# EAGLE design IRIS1304_v1.3 (EAGLE 6.6.0)
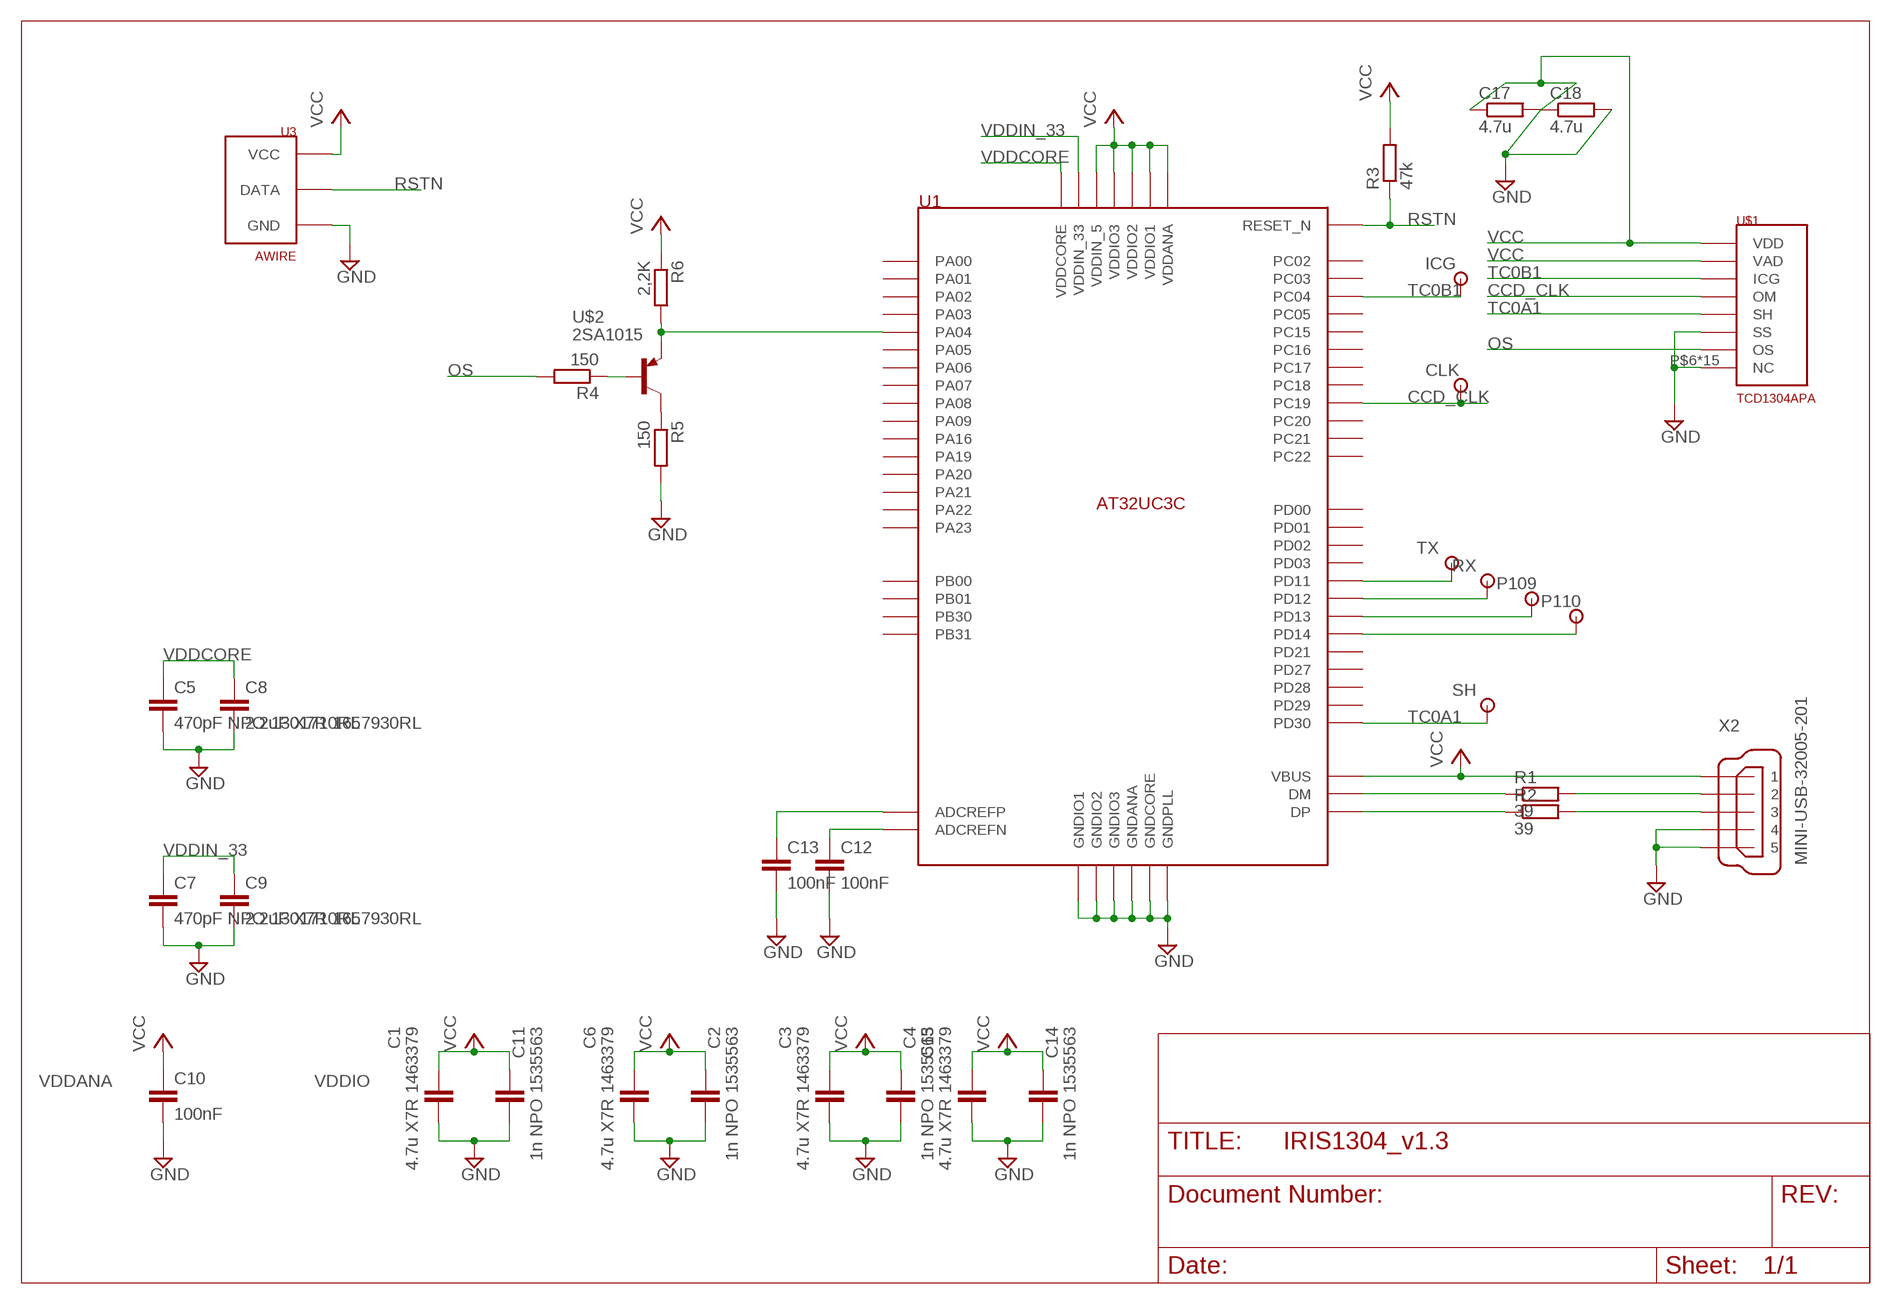
[diagram p0: schematic, sheet 1]

## Parts
C1  4.7u X7R 1463379  C-EUC0603  [C0603]
C2  1n NPO 1535563  C-EUC0402  [C0402]
C3  4.7u X7R 1463379  C-EUC0603  [C0603]
C4  1n NPO 1535563  C-EUC0402  [C0402]
C5  470pF NPO 1301710RL  C-EUC0603  [C0603]
C6  4.7u X7R 1463379  C-EUC0603  [C0603]
C7  470pF NPO 1301710RL  C-EUC0603  [C0603]
C8  2.2uF X7R 1657930RL  C-EUC0603  [C0603]
C9  2.2uF X7R 1657930RL  C-EUC0603  [C0603]
C10  100nF  C-EUC0603  [C0603]
C11  1n NPO 1535563  C-EUC0402  [C0402]
C12  100nF  C-EUC0603  [C0603]
C13  100nF  C-EUC0603  [C0603]
C14  1n NPO 1535563  C-EUC0402  [C0402]
C15  4.7u X7R 1463379  C-EUC0603  [C0603]
C17  4.7u  R-EU_R0603  [R0603]
C18  4.7u  R-EU_R0603  [R0603]
CLK  TP  [TP]
ICG  TP  [TP]
P109  TP  [TP]
P110  TP  [TP]
R1  39  R-EU_R0603  [R0603]
R2  39  R-EU_R0603  [R0603]
R3  47k  R-EU_R0603  [R0603]
R4  150  R-EU_R0603  [R0603]
R5  150  R-EU_M0805  [M0805]
R6  2,2K  R-EU_R0603  [R0603]
RX  TP  [TP]
SH  TP  [TP]
TX  TP  [TP]
U1  AT32UC3C  [TQFP64]
U3  AWIRE  [AWIRE]
U$1  TCD1304APA  [ILX511]
U$2  2SA1015  [SOT23]
X2  MINI-USB-32005-201  [32005-201]

## Nets
CCD_CLK: CLK.P$1 U1.P$43(PC19) U$1.P$4(OM)
GND: C1.2 C2.2 C3.2 C4.2 C5.2 C6.2 C7.2 C8.2 C9.2 C10.2 C11.2 C12.2 C13.2 C14.2 C15.2 C17.2 C18.2 R5.2 U1.P$6(GNDIO1) U1.P$17(GNDANA) U1.P$26(GNDPLL) U1.P$30(GNDCORE) U1.P$36(GNDIO2) U1.P$52(GNDIO3) U3.P$3(GND) U$1.P$6(NC) U$1.P$7(NC) U$1.P$8(NC) U$1.P$9(NC) U$1.P$10(NC) U$1.P$11(NC) U$1.P$12(NC) U$1.P$13(NC) U$1.P$14(NC) U$1.P$15(NC) U$1.P$16(NC) U$1.P$17(NC) U$1.P$18(NC) U$1.P$19(NC) U$1.P$20(NC) U$1.P$22(SS) X2.4 X2.5
N$1: R1.1 U1.P$24(DM)
N$2: R2.1 U1.P$25(DP)
N$3: R1.2 X2.2
N$4: R2.2 X2.3
N$5: R6.2 U1.P$7(PA04) U$2.2(E)
N$6: C13.1 U1.P$14(ADCREFP)
N$7: R5.1 U$2.3(C)
N$8: R4.1 U$2.1(B)
N$9: C12.1 U1.P$15(ADCREFN)
N$10: P109.P$1 U1.P$55(PD13)
N$11: RX.P$1 U1.P$54(PD12)
N$12: P110.P$1 U1.P$56(PD14)
N$13: TX.P$1 U1.P$53(PD11)
OS: R4.2 U$1.P$21(OS)
RSTN: R3.1 U1.P$64(RESET_N) U3.P$2(DATA)
TC0A1: SH.P$1 U1.P$61(PD30) U$1.P$5(SH)
TC0B1: ICG.P$1 U1.P$37(PC04) U$1.P$3(ICG)
VCC: C1.1 C2.1 C3.1 C4.1 C6.1 C10.1 C11.1 C14.1 C15.1 C17.1 C18.1 R3.2 R6.1 U1.P$5(VDDIO1) U1.P$18(VDDANA) U1.P$23(VBUS) U1.P$27(VDDIN_5) U1.P$35(VDDIO2) U1.P$51(VDDIO3) U3.P$1(VCC) U$1.P$1(VDD) U$1.P$2(VAD) X2.1
VDDCORE: C5.1 C8.1 U1.P$29(VDDCORE)
VDDIN_33: C7.1 C9.1 U1.P$28(VDDIN_33)
Unconnected: U1.P$1(PA00) U1.P$2(PA01) U1.P$3(PA02) U1.P$4(PA03) U1.P$8(PA05) U1.P$9(PA06) U1.P$10(PA07) U1.P$11(PA08) U1.P$12(PA09) U1.P$13(PA16) U1.P$16(PA19) U1.P$19(PA20) U1.P$20(PA21) U1.P$21(PA22) U1.P$22(PA23) U1.P$31(PB30) U1.P$32(PB31) U1.P$33(PC02) U1.P$34(PC03) U1.P$38(PC05) U1.P$39(PC15) U1.P$40(PC16) U1.P$41(PC17) U1.P$42(PC18) U1.P$44(PC20) U1.P$45(PC21) U1.P$46(PC22) U1.P$47(PD00) U1.P$48(PD01) U1.P$49(PD02) U1.P$50(PD03) U1.P$57(PD21) U1.P$58(PD27) U1.P$59(PD28) U1.P$60(PD29) U1.P$62(PB00) U1.P$63(PB01)

## Notes on the sheet
- VDDANA | VDDIO

## Library data of the parts
C1 C3 C6 C15 = rcl:C-EU: CAPACITOR, European symbol; MF: AVX; MPN: 0201YC101KAT2A; OC_FARNELL: 2112822
C2 C4 C5 C7-C14 = rcl:C-EU: CAPACITOR, European symbol; OC_FARNELL: unknown
C17 C18 R1 R2 = resistor:R-EU_: RESISTOR, European symbol; OC_FARNELL: unknown
CLK ICG P109 P110 RX SH TX = IRIS:TP
R3 = rcl:R-EU_: RESISTOR, European symbol; OC_FARNELL: unknown
R4 R6 = resistor:R-EU_: RESISTOR, European symbol
R5 = rcl:R-EU_: RESISTOR, European symbol
U1 = IRIS:AT32UC3C; OC_FARNELL: unknown
U3 = IRIS:AWIRE; OC_FARNELL: unknown
U$1 = SpectroLib:TCD1304AP; OC_FARNELL: unknown
U$2 = IRIS:2SA1015
X2 = con-cypressindustries:MINI-USB-: MINI USB-B Conector Source: www.cypressindustries.com; OC_FARNELL: unknown; OC_NEWARK: unknown

## Board
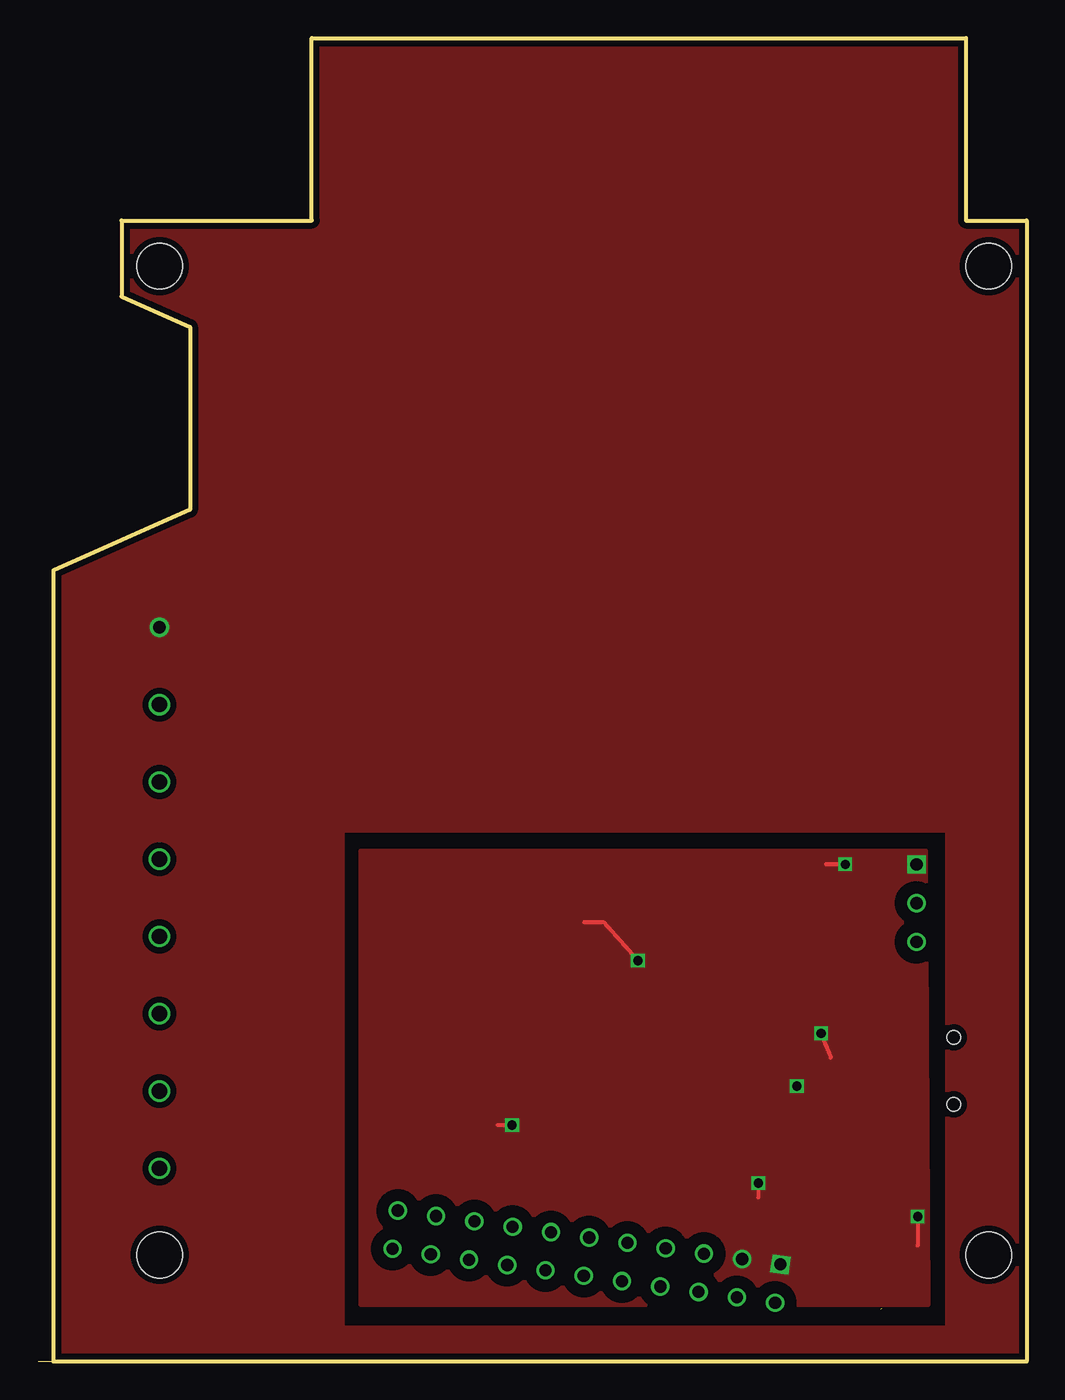
[diagram p1: board, top side]
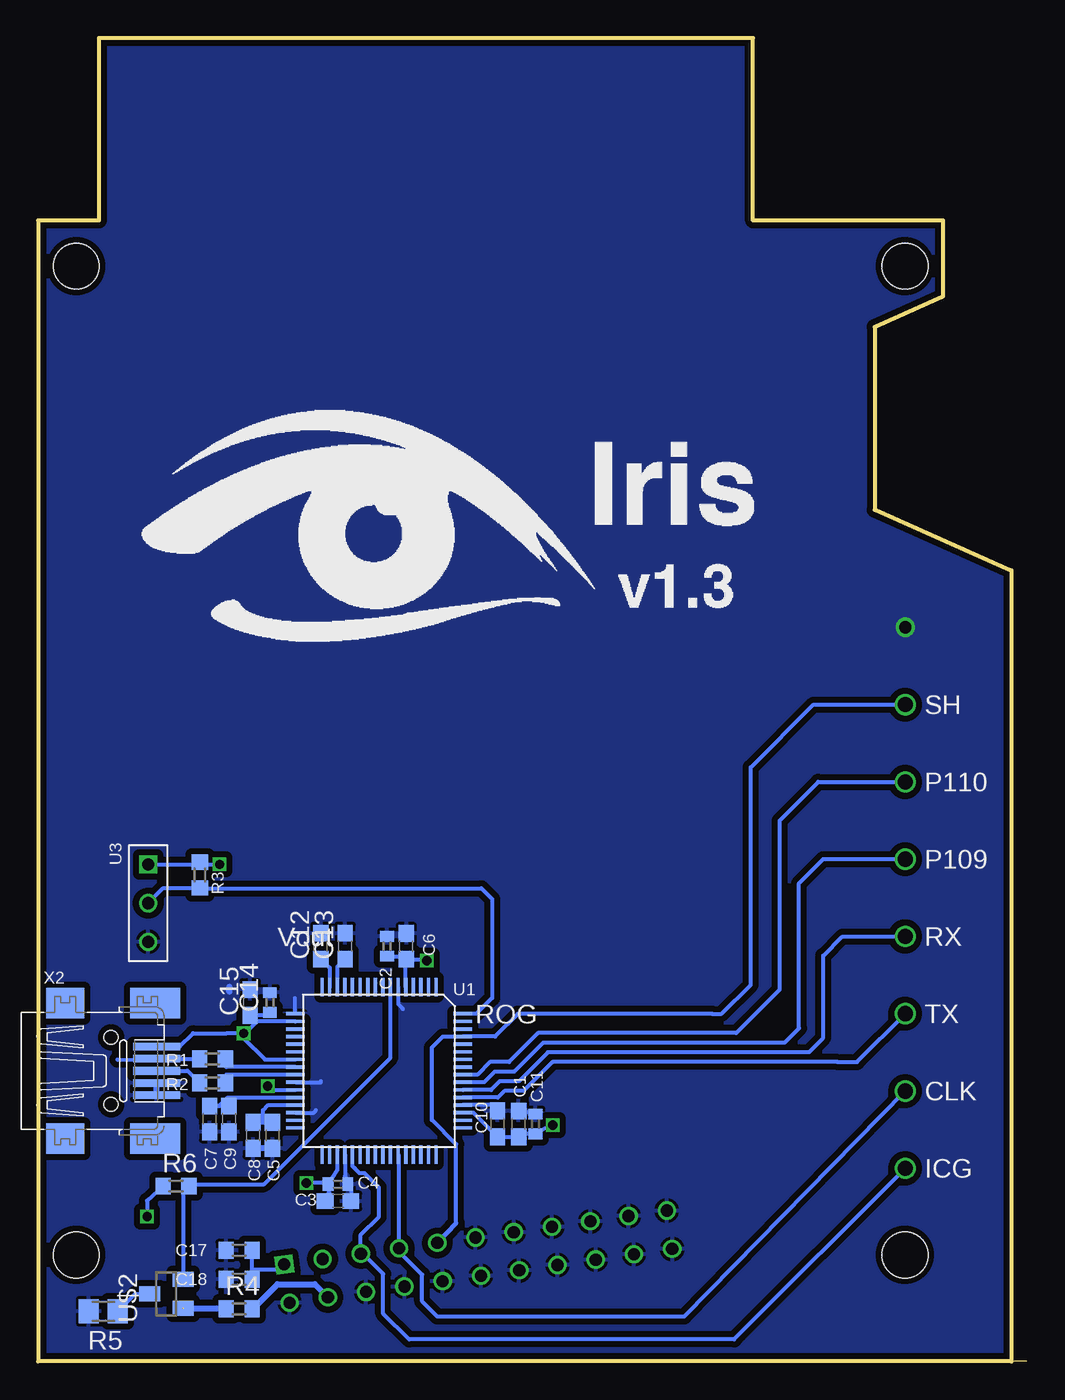
[diagram p2: board, bottom side, seen from below]

Size 65 x 87 mm. Coordinates in mm from the lower left corner, seen from the top.
Outline: 0,0 1,0
Outline: 1,0 65,0 65,75 61,75 61,87 18,87 18,75 5.5,75 5.5,70 10,68 10,56 1,52 1,0
Copper layers (1*16): Top 0.035mm / dielectric 1.5mm / Bottom 0.035mm
Design rules "PCB-POOL Standard": minimum track width 0.15mm, minimum drill 0.3mm, track to track 0.15mm, track to pad 0.15mm, pad to pad 0.15mm, via to via 0.15mm, smd to smd 0.15mm, copper to edge 0.3mm, drill to drill 0.2mm, minimum pad ring 0.2mm, minimum via ring 0.15mm, stop-mask expansion 0.075mm, vias tented up to drill 0mil, thermal gap 0.2mm
Holes 3 mm at 8,7 62.5,7 62.5,72 8,72

### Footprints (pad centres in the part's own frame; a part is rotated, then mirrored left to right if it is on the bottom)
C0603 = smd 1.1 x 1: 1 -0.85,0; 2 0.85,0
C0402 = smd 0.7 x 0.9: 1 -0.65,0; 2 0.65,0
R0603 = smd 1 x 1.1: 1 -0.85,0; 2 0.85,0
TP = drill 1: P$1 0,0
M0805 = smd 1.3 x 1.6: 1 -0.95,0; 2 0.95,0
TQFP64 = smd 1.2 x 0.22: P$1 -5.5,3.75; P$2 -5.5,3.25; P$3 -5.5,2.75; P$4 -5.5,2.25; P$5 -5.5,1.75; P$6 -5.5,1.25; P$7 -5.5,0.75; P$8 -5.5,0.25; P$9 -5.5,-0.25; P$10 -5.5,-0.75; P$11 -5.5,-1.25; P$12 -5.5,-1.75; P$13 -5.5,-2.25; P$14 -5.5,-2.75; P$15 -5.5,-3.25; P$16 -5.5,-3.75; P$33 5.5,-3.75; P$34 5.5,-3.25; P$35 5.5,-2.75; P$36 5.5,-2.25; P$37 5.5,-1.75; P$38 5.5,-1.25; P$39 5.5,-0.75; P$40 5.5,-0.25; P$41 5.5,0.25; P$42 5.5,0.75; P$43 5.5,1.25; P$44 5.5,1.75; P$45 5.5,2.25; P$46 5.5,2.75; P$47 5.5,3.25; P$48 5.5,3.75 | smd 0.22 x 1.2: P$17 -3.75,-5.5; P$18 -3.25,-5.5; P$19 -2.75,-5.5; P$20 -2.25,-5.5; P$21 -1.75,-5.5; P$22 -1.25,-5.5; P$23 -0.75,-5.5; P$24 -0.25,-5.5; P$25 0.25,-5.5; P$26 0.75,-5.5; P$27 1.25,-5.5; P$28 1.75,-5.5; P$29 2.25,-5.5; P$30 2.75,-5.5; P$31 3.25,-5.5; P$32 3.75,-5.5; P$49 3.75,5.5; P$50 3.25,5.5; P$51 2.75,5.5; P$52 2.25,5.5; P$53 1.75,5.5; P$54 1.25,5.5; P$55 0.75,5.5; P$56 0.25,5.5; P$57 -0.25,5.5; P$58 -0.75,5.5; P$59 -1.25,5.5; P$60 -1.75,5.5; P$61 -2.25,5.5; P$62 -2.75,5.5; P$63 -3.25,5.5; P$64 -3.75,5.5
AWIRE = drill 0.8 square: P$1 -2.54,1.27 | drill 0.8: P$2 0,1.27; P$3 2.54,1.27
ILX511 = drill 0.8 square: P$1 0,0 | drill 0.8: P$2 -2.54,0; P$3 -5.08,0; P$4 -7.62,0; P$5 -10.16,0; P$6 -12.7,0; P$7 -15.24,0; P$8 -17.78,0; P$9 -20.32,0; P$10 -22.86,0; P$11 -25.4,0; P$12 -25.4,-2.54; P$13 -22.86,-2.54; P$14 -20.32,-2.54; P$15 -17.78,-2.54; P$16 -15.24,-2.54; P$17 -12.7,-2.54; P$18 -10.16,-2.54; P$19 -7.62,-2.54; P$20 -5.08,-2.54; P$21 -2.54,-2.54; P$22 0,-2.54
SOT23 = smd 1 x 1.4: 1 -0.95,-1.1; 2 0.95,-1.1; 3 0,1.1
32005-201 = smd 3.1 x 0.5: 1 3,1.6; 2 3,0.8; 3 3,0; 4 3,-0.8; 5 3,-1.6 | smd 2.5 x 2: M1 -3,-4.45; M2 -3,4.45 | smd 3.3 x 2: M3 2.9,4.45; M4 2.9,-4.45 | hole 0.9: 0,2.2; 0,-2.2

### Placement (x,y rotation side)
C1  33.4,15.61 90 bottom
C2  42.05,27.29 90 bottom
C3  45.28,10.54 0 bottom
C4  45.28,11.65 0 bottom
C5  49.59,14.87 270 bottom
C6  40.78,27.29 90 bottom
C7  53.72,15.94 270 bottom
C8  50.86,14.87 270 bottom
C9  52.45,15.94 270 bottom
C10  34.8,15.62 90 bottom
C11  32.29,15.61 90 bottom
C12  46.4,27.3 90 bottom
C13  44.81,27.3 90 bottom
C14  49.75,23.6 90 bottom
C15  51.05,23.6 90 bottom
C17  51.78,7.3 180 bottom
C18  51.78,5.4 180 bottom
CLK  7.99,17.78 0 bottom
ICG  7.99,12.7 0 bottom
P109  7.99,33.02 0 bottom
P110  7.99,38.1 0 bottom
R1  53.53,19.9 180 bottom
R2  53.53,18.31 180 bottom
R3  54.35,31.97 90 bottom
R4  51.78,3.46 0 bottom
R5  60.71,3.3 180 bottom
R6  55.93,11.53 0 bottom
RX  7.99,27.94 0 bottom
SH  7.99,43.18 0 bottom
TX  7.99,22.86 0 bottom
U1  42.58,19.11 270 bottom
U3  59.03,30.13 270 bottom
U$1  48.81,6.38 352 top
U$2  56.56,4.45 90 bottom
X2  60.2,19.11 0 bottom

### Tracks (layer width: path | path; a pad name or v marks a point on that pad's centre or on a via)
CCD_CLK
  Bottom 0.254: U1.P$43 41.26,13.54 U$1.P$4 41.26,7.21 39.75,5.7 39.75,3.95 38.75,2.95 22.52,2.95 CLK.P$1
GND  (via drill 0.8 pad 1.27)
  Bottom 0.254: U1.P$36 44.83,12.17 C4.2 44.43,11.45 C3.2 | U1.P$30 46.88,16.36 46.72,16.51 | C1.2 33.52,16.58 C11.2 | C10.2 35.18,16.86 U1.P$52 | U1.P$17 48.1,22.88 48.1,23.9 | U1.P$26 46.4,18.36 46.4,18.41 | U1.P$6 41.33,23.5 41.01,23.18
  Bottom 0.406: C5.2 C8.2 | 52.42,24.31 52.42,24.63 | X2.5 X2.4
  other vias: 7.99,48.26
  pour Bottom (isolate 0.406): 1,87 65,87 65,0 1,0
  pour Top (isolate 0.406): -2.81,87.95 -2.81,-1.27 59.58,-1.27 59.58,2.22 20.05,2.22 20.05,34.91 59.74,34.91 59.74,-1.27 66.72,-1.27 66.72,87.95
N$1
  Bottom 0.254: U1.P$24 52.61,19.36 R1.1
N$2
  Bottom 0.254: U1.P$25 52.61,18.86 R2.1
N$3
  Bottom 0.254: 59.77,19.84 X2.2 | 56.64,19.87 56.61,19.9 R1.2
  Bottom 0.406: X2.2 56.64,19.87
N$4
  Bottom 0.254: X2.3 55.17,19.11 R2.2
N$5
  Bottom 0.254: U1.P$7 41.83,19.97 50.15,11.65 54.85,11.65 R6.2 55.46,11.04 U$2.2
N$6
  Bottom 0.254: C13.1 45.33,25.94 U1.P$14
N$7
  Bottom 0.254: R5.1 58.62,4.45 U$2.3
N$8  (1 unrouted)
  Bottom 0.406: R4.1 55.42,3.46
N$9
  Bottom 0.254: C12.1 45.83,25.88 U1.P$15
N$10
  Bottom 0.254: U1.P$55 35.67,18.36 34.97,19.05 33.7,19.05 31.8,20.95 15.92,20.95 14.97,21.91 14.97,31.43 13.38,33.02 P109.P$1
N$11
  Bottom 0.254: U1.P$54 35.22,17.86 34.66,18.41 33.38,18.41 31.48,20.32 14.34,20.32 13.38,21.27 13.38,26.67 12.11,27.94 RX.P$1
N$12
  Bottom 0.254: U1.P$56 36.12,18.86 35.29,19.68 34.02,19.68 32.11,21.59 19.1,21.59 16.24,24.45 16.24,35.56 13.7,38.1 P110.P$1
N$13
  Bottom 0.254: U1.P$53 34.76,17.36 34.34,17.78 33.07,17.78 31.16,19.68 12.43,19.68 11.16,19.68 TX.P$1
OS
  Bottom 0.406: R4.2 50.83,3.51 49.26,5.08 46.8,5.08 U$1.P$21
RSTN
  Bottom 0.254: U1.P$64 36.2,22.86 35.15,23.9 35.15,30.4 35.85,31.1 54.33,31.1 R3.1 56.76,31.12 U3.P$2
TC0A1
  Bottom 0.254: 37.51,9.1 37.51,14.29 39.1,15.88 39.1,20.64 38.38,21.36 U1.P$61 34.95,21.36 33.45,22.85 20.68,22.85 20.06,22.85 18.14,24.77 18.14,39.05 14.02,43.18 SH.P$1
  Bottom 0.305: 37.51,9.1 U$1.P$5
TC0B1
  Bottom 0.254: U1.P$37 44.33,12.85 44.18,12.7 43.86,12.38 43.55,12.38 42.59,11.43 42.59,9.53 43.78,8.34 U$1.P$3 43.64,7.09 42.3,5.75 42.3,3.15 40.6,1.45 19.23,1.45 ICG.P$1
VCC  (via drill 0.6, 0.6 pad 0.81)
  Top 0.254: v31.16,15.54 30.21,15.54 | v53.07,32.68 51.8,32.68 | v47.35,11.73 47.35,10.78 | v39.44,26.35 37.2,28.87 35.92,28.87 | v51.48,21.57 52.12,19.98 | v57.83,9.53 57.83,7.62
  Bottom 0.254: C3.1 45.86,11.1 C4.1 | U1.P$18 50.6,22.36 50.73,22.23 | C1.1 33.4,14.82 33.26,14.96 C11.1 31.22,15.6 v31.16,15.54 | X2.1 55.68,20.7 54.82,21.57 52.6,21.57 v51.48,21.57 | C1.1 | U1.P$5 40.83,26.09 40.83,26.39 C6.1 | U1.P$35 45.33,12.57 C4.1 | U3.P$1 54.51,32.67 | 54.51,32.67 R3.2 | 54.51,32.67 53.09,32.67 v53.07,32.68 | C18.1 50.93,6.03 | 50.93,6.03 50.93,6.35 C17.1 | C4.1 46,11.73 v47.35,11.73 | C6.1 41.02,26.83 | 51.48,21.25 50.09,19.86 | 50.09,19.86 U1.P$23 | 50.09,19.86 51.48,21.25 | 51.48,21.25 v51.48,21.57 | C1.1 C10.1 36.38,16.36 U1.P$51 | 50.93,6.03 49.16,6.03 U$1.P$1 | v49.9,18.1 49.65,17.86 U1.P$27 | 50.73,22.23 51.38,21.57 | 51.38,21.57 v51.48,21.57 | 51.38,21.57 51.48,21.47 v51.48,21.57 | R6.1 57.83,10.57 v57.83,9.53 | C14.1 49.95,22.75 C15.1 50.73,22.43 50.73,22.23 | C2.1 40.98,26.64 C6.1 | C6.1 39.52,26.44 v39.44,26.35
  pour Top (isolate 0.813, no thermals): 21.22,3.7 21.22,33.6 58.37,33.6 58.52,3.7
VDDCORE
  Bottom 0.254: C8.1 C5.1 50.21,15.73 50.21,16.51 49.87,16.86 U1.P$29
VDDIN_33
  Bottom 0.254: C9.1 C7.1 53.09,16.79 52.52,17.36 U1.P$28

### Text on the board
bNames: Vout | ROG